# EAGLE design PatchBay (EAGLE 6.6.0)
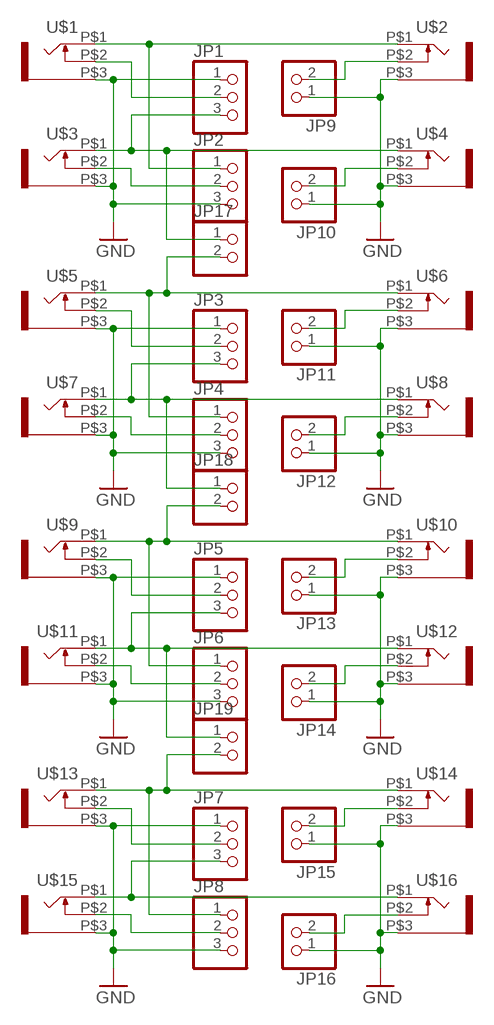
[diagram p0: schematic, sheet 1]

## Parts
JP1  PINHD-1X3  [1X03]
JP2  PINHD-1X3  [1X03]
JP3  PINHD-1X3  [1X03]
JP4  PINHD-1X3  [1X03]
JP5  PINHD-1X3  [1X03]
JP6  PINHD-1X3  [1X03]
JP7  PINHD-1X3  [1X03]
JP8  PINHD-1X3  [1X03]
JP9  PINHD-1X2  [1X02]
JP10  PINHD-1X2  [1X02]
JP11  PINHD-1X2  [1X02]
JP12  PINHD-1X2  [1X02]
JP13  PINHD-1X2  [1X02]
JP14  PINHD-1X2  [1X02]
JP15  PINHD-1X2  [1X02]
JP16  PINHD-1X2  [1X02]
JP17  PINHD-1X2  [1X02]
JP18  PINHD-1X2  [1X02]
JP19  PINHD-1X2  [1X02]
U$1  JACK-UJ-3502-R  [UJ-3502-R]
U$2  JACK-UJ-3502-R  [UJ-3502-R]
U$3  JACK-UJ-3502-R  [UJ-3502-R]
U$4  JACK-UJ-3502-R  [UJ-3502-R]
U$5  JACK-UJ-3502-R  [UJ-3502-R]
U$6  JACK-UJ-3502-R  [UJ-3502-R]
U$7  JACK-UJ-3502-R  [UJ-3502-R]
U$8  JACK-UJ-3502-R  [UJ-3502-R]
U$9  JACK-UJ-3502-R  [UJ-3502-R]
U$10  JACK-UJ-3502-R  [UJ-3502-R]
U$11  JACK-UJ-3502-R  [UJ-3502-R]
U$12  JACK-UJ-3502-R  [UJ-3502-R]
U$13  JACK-UJ-3502-R  [UJ-3502-R]
U$14  JACK-UJ-3502-R  [UJ-3502-R]
U$15  JACK-UJ-3502-R  [UJ-3502-R]
U$16  JACK-UJ-3502-R  [UJ-3502-R]

## Nets
GND: JP1.1 JP2.3 JP3.1 JP4.3 JP5.1 JP6.3 JP7.1 JP8.3 JP9.1 JP10.1 JP11.1 JP12.1 JP13.1 JP14.1 JP15.1 JP16.1 U$1.P$3(SLEEVE) U$2.P$3(SLEEVE) U$3.P$3(SLEEVE) U$4.P$3(SLEEVE) U$5.P$3(SLEEVE) U$6.P$3(SLEEVE) U$7.P$3(SLEEVE) U$8.P$3(SLEEVE) U$9.P$3(SLEEVE) U$10.P$3(SLEEVE) U$11.P$3(SLEEVE) U$12.P$3(SLEEVE) U$13.P$3(SLEEVE) U$14.P$3(SLEEVE) U$15.P$3(SLEEVE) U$16.P$3(SLEEVE)
N$1: JP1.3 JP17.1 U$3.P$1(TIP) U$4.P$1(TIP)
N$2: JP2.1 U$1.P$1(TIP) U$2.P$1(TIP)
N$3: JP1.2 U$1.P$2(SW)
N$4: JP2.2 U$3.P$2(SW)
N$5: JP3.3 JP18.1 U$7.P$1(TIP) U$8.P$1(TIP)
N$6: JP4.1 JP17.2 U$5.P$1(TIP) U$6.P$1(TIP)
N$7: JP3.2 U$5.P$2(SW)
N$8: JP4.2 U$7.P$2(SW)
N$9: JP5.3 JP19.1 U$11.P$1(TIP) U$12.P$1(TIP)
N$10: JP6.1 JP18.2 U$9.P$1(TIP) U$10.P$1(TIP)
N$11: JP5.2 U$9.P$2(SW)
N$12: JP6.2 U$11.P$2(SW)
N$13: JP7.3 U$15.P$1(TIP) U$16.P$1(TIP)
N$14: JP8.1 JP19.2 U$13.P$1(TIP) U$14.P$1(TIP)
N$15: JP7.2 U$13.P$2(SW)
N$16: JP8.2 U$15.P$2(SW)
N$17: JP14.2 U$12.P$2(SW)
N$18: JP13.2 U$10.P$2(SW)
N$19: JP12.2 U$8.P$2(SW)
N$20: JP11.2 U$6.P$2(SW)
N$21: JP10.2 U$4.P$2(SW)
N$22: JP9.2 U$2.P$2(SW)
N$23: JP15.2 U$14.P$2(SW)
N$24: JP16.2 U$16.P$2(SW)

## Library data of the parts
JP1-JP8 = pinhead:PINHD-1X3: PIN HEADER
JP9-JP19 = pinhead:PINHD-1X2: PIN HEADER
U$1-U$16 = Rebel:JACK-UJ-3502-R

## Board
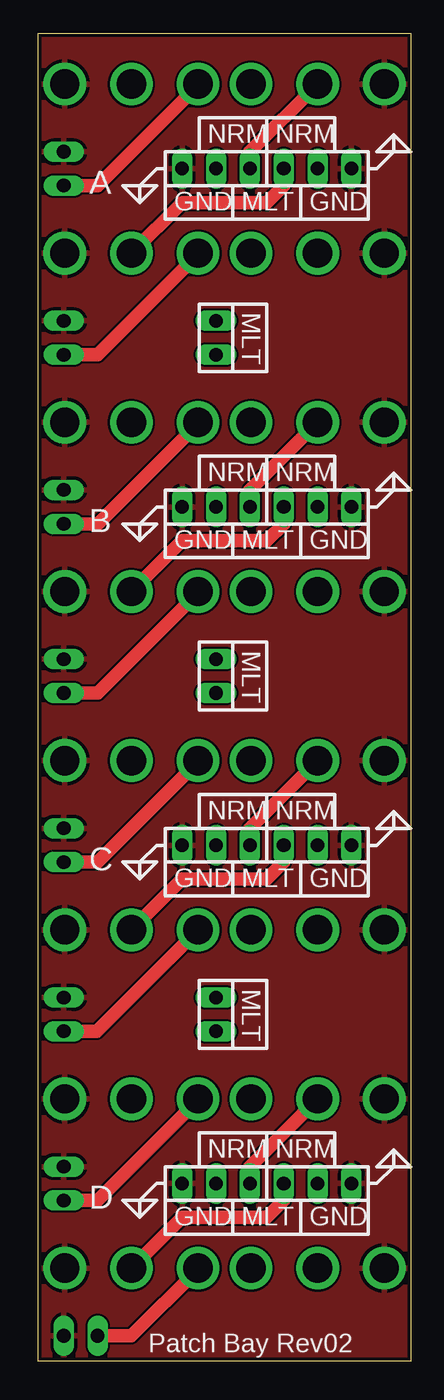
[diagram p1: board, top side]
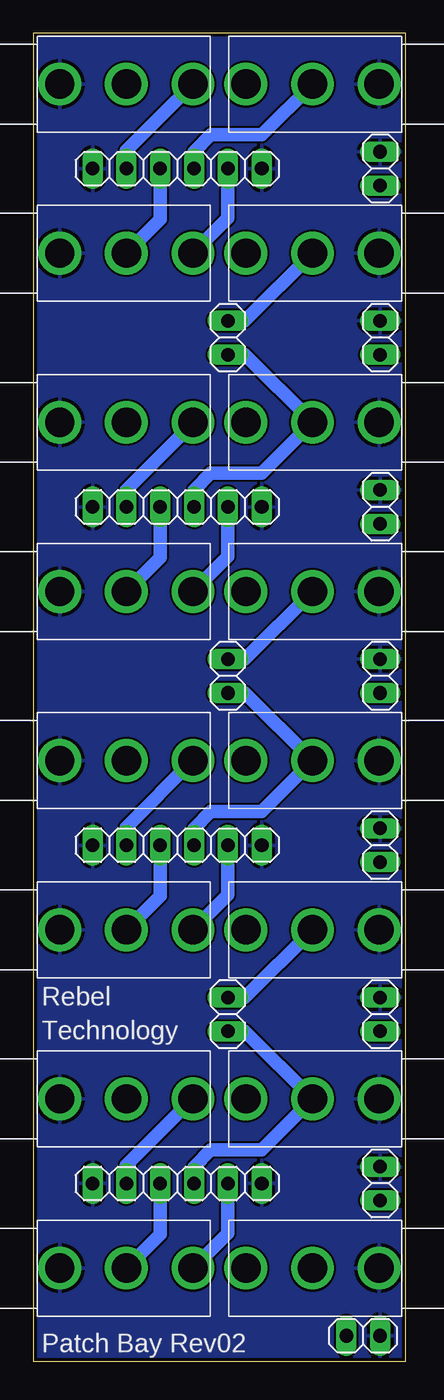
[diagram p2: board, bottom side, seen from below]

Size 27.94 x 99.69 mm. Coordinates in mm from the lower left corner, seen from the top.
Outline: 27.94,99.69 27.94,0 0,0 0,99.69 27.94,99.69
Copper layers (1*16): Top 0.035mm / dielectric 1.5mm / Bottom 0.035mm
Design rules "Fusion_eagle_rule_v1.1": minimum track width 6mil, minimum drill 12mil, track to track 6mil, track to pad 6mil, pad to pad 6mil, via to via 6mil, smd to smd 0mil, copper to edge 10mil, drill to drill 10mil, minimum pad ring 10mil, minimum via ring 6mil, stop-mask expansion 2mil, vias tented up to drill 100mil, thermal gap 10mil

### Footprints (pad centres in the part's own frame; a part is rotated, then mirrored left to right if it is on the bottom)
1X03 = drill 1.016 long: 1 -2.54,0; 2 0,0; 3 2.54,0
1X02 = drill 1.016 long: 1 -1.27,0; 2 1.27,0
UJ-3502-R = drill 2.2: P$1 0,0; P$2 0,5; P$3 0,-5

### Placement (x,y rotation side)
JP1  20.95,89.53 0 bottom
JP2  13.34,89.53 0 bottom
JP3  20.95,64.13 0 bottom
JP4  13.34,64.13 0 bottom
JP5  20.95,38.73 0 bottom
JP6  13.34,38.73 0 bottom
JP7  20.95,13.34 0 bottom
JP8  13.34,13.34 0 bottom
JP9  1.91,89.53 270 bottom
JP10  1.91,76.83 270 bottom
JP11  1.91,64.13 270 bottom
JP12  1.91,51.44 270 bottom
JP13  1.91,38.73 270 bottom
JP14  1.91,26.04 270 bottom
JP15  1.91,13.34 270 bottom
JP16  3.17,1.91 180 bottom
JP17  13.34,76.83 270 bottom
JP18  13.34,51.44 270 bottom
JP19  13.34,26.04 270 bottom
U$1  20.95,95.88 270 bottom
U$2  6.99,95.88 90 bottom
U$3  20.95,83.18 270 bottom
U$4  6.99,83.18 90 bottom
U$5  20.95,70.48 270 bottom
U$6  6.99,70.48 90 bottom
U$7  20.95,57.79 270 bottom
U$8  6.99,57.79 90 bottom
U$9  20.95,45.09 270 bottom
U$10  6.99,45.09 90 bottom
U$11  20.95,32.39 270 bottom
U$12  6.99,32.39 90 bottom
U$13  20.95,19.68 270 bottom
U$14  6.99,19.68 90 bottom
U$15  20.95,6.99 270 bottom
U$16  6.99,6.99 90 bottom

### Tracks (layer width: path | path; a pad name or v marks a point on that pad's centre or on a via)
GND
  pour Top: -0.64,99.69 28.57,99.69 28.57,-0.64 -0.64,-0.64
  pour Bottom: -0.64,99.69 28.57,99.69 28.57,-0.64 -0.64,-0.64
N$1
  Top 1.016: U$4.P$1 10.79,86.99 17.14,86.99 18.41,88.27 JP1.3
  Bottom 1.016: JP1.3 18.41,85.72 U$3.P$1 | JP17.1 12.06,78.1 U$4.P$1
N$2
  Top 1.016: U$1.P$1 15.88,90.8 JP2.1
  Bottom 1.016: JP2.1 15.88,90.8 14.61,92.07 10.79,92.07 U$2.P$1
N$3
  Bottom 1.016: JP1.2 20.95,90.88 U$1.P$2
N$4
  Bottom 1.016: JP2.2 13.34,85.8 U$3.P$2
N$5
  Top 1.016: JP3.3 18.41,62.87 17.14,61.59 10.79,61.59 U$8.P$1
  Bottom 1.016: U$7.P$1 18.41,60.33 JP3.3 | JP18.1 12.06,52.71 U$8.P$1
N$6
  Top 1.016: U$5.P$1 15.88,65.41 JP4.1
  Bottom 1.016: JP4.1 15.88,65.41 14.61,66.67 10.79,66.67 U$6.P$1 12.06,75.56 JP17.2
N$7
  Bottom 1.016: U$5.P$2 15.96,70.41 20.95,65.41 JP3.2
N$8
  Bottom 1.016: JP4.2 13.34,60.41 U$7.P$2
N$9
  Top 1.016: JP5.3 18.41,37.47 17.14,36.2 10.79,36.2 U$12.P$1
  Bottom 1.016: U$11.P$1 18.41,34.93 JP5.3 | JP19.1 12.06,27.3 U$12.P$1
N$10
  Top 1.016: U$9.P$1 15.88,40.01 JP6.1
  Bottom 1.016: JP6.1 15.88,40.01 14.61,41.27 10.79,41.27 U$10.P$1 12.06,50.16 JP18.2
N$11
  Bottom 1.016: JP5.2 20.95,40.09 U$9.P$2
N$12
  Bottom 1.016: JP6.2 13.34,35.01 U$11.P$2
N$13
  Top 1.016: JP7.3 18.41,12.06 17.14,10.79 10.79,10.79 U$16.P$1
  Bottom 1.016: JP7.3 18.41,9.53 U$15.P$1
N$14
  Top 1.016: U$13.P$1 15.88,14.61 JP8.1
  Bottom 1.016: JP8.1 15.88,14.61 14.61,15.88 10.79,15.88 U$14.P$1 12.06,24.76 JP19.2
N$15
  Bottom 1.016: JP7.2 20.95,14.69 U$13.P$2
N$16
  Bottom 1.016: JP8.2 13.34,9.61 U$15.P$2
N$17
  Top 1.016: JP14.2 4.37,24.76 U$12.P$2
N$18
  Top 1.016: U$10.P$2 11.98,45.01 4.45,37.47 JP13.2
N$19
  Top 1.016: U$8.P$2 11.98,57.71 4.45,50.16 JP12.2
N$20
  Top 1.016: U$6.P$2 11.98,70.41 4.45,62.87 JP11.2
N$21
  Top 1.016: U$4.P$2 11.98,83.1 4.45,75.56 JP10.2
N$22
  Top 0.508: U$2.P$2 11.98,95.8
  Top 1.016: 11.98,95.8 4.45,88.27 JP9.2
N$23
  Top 1.016: U$14.P$2 11.98,19.6 4.45,12.06 JP15.2
N$24
  Top 1.016: U$16.P$2 11.98,6.91 6.99,1.91 JP16.2

### Text on the board
tPlace: NRM | NRM | A | GND | MLT | GND | MLT | NRM | NRM | B | GND | MLT | GND | MLT | NRM | NRM | C | GND | MLT | GND | MLT | NRM | NRM | D | GND | MLT | GND | Patch Bay Rev02
bPlace: Rebel | Technology | Patch Bay Rev02